# EAGLE design TeenAstro_Mini_v2-5-3_M12_a6 (EAGLE 9.6.2)
TeenAstroMini version 2.5.3 avec codeurs - Teensy 4.0 - connecteurs M12A-05 et RJ45 (encodeurs) - Réticule et capteur limite à câbler - liaison sans soudures encodeurs-Teensy
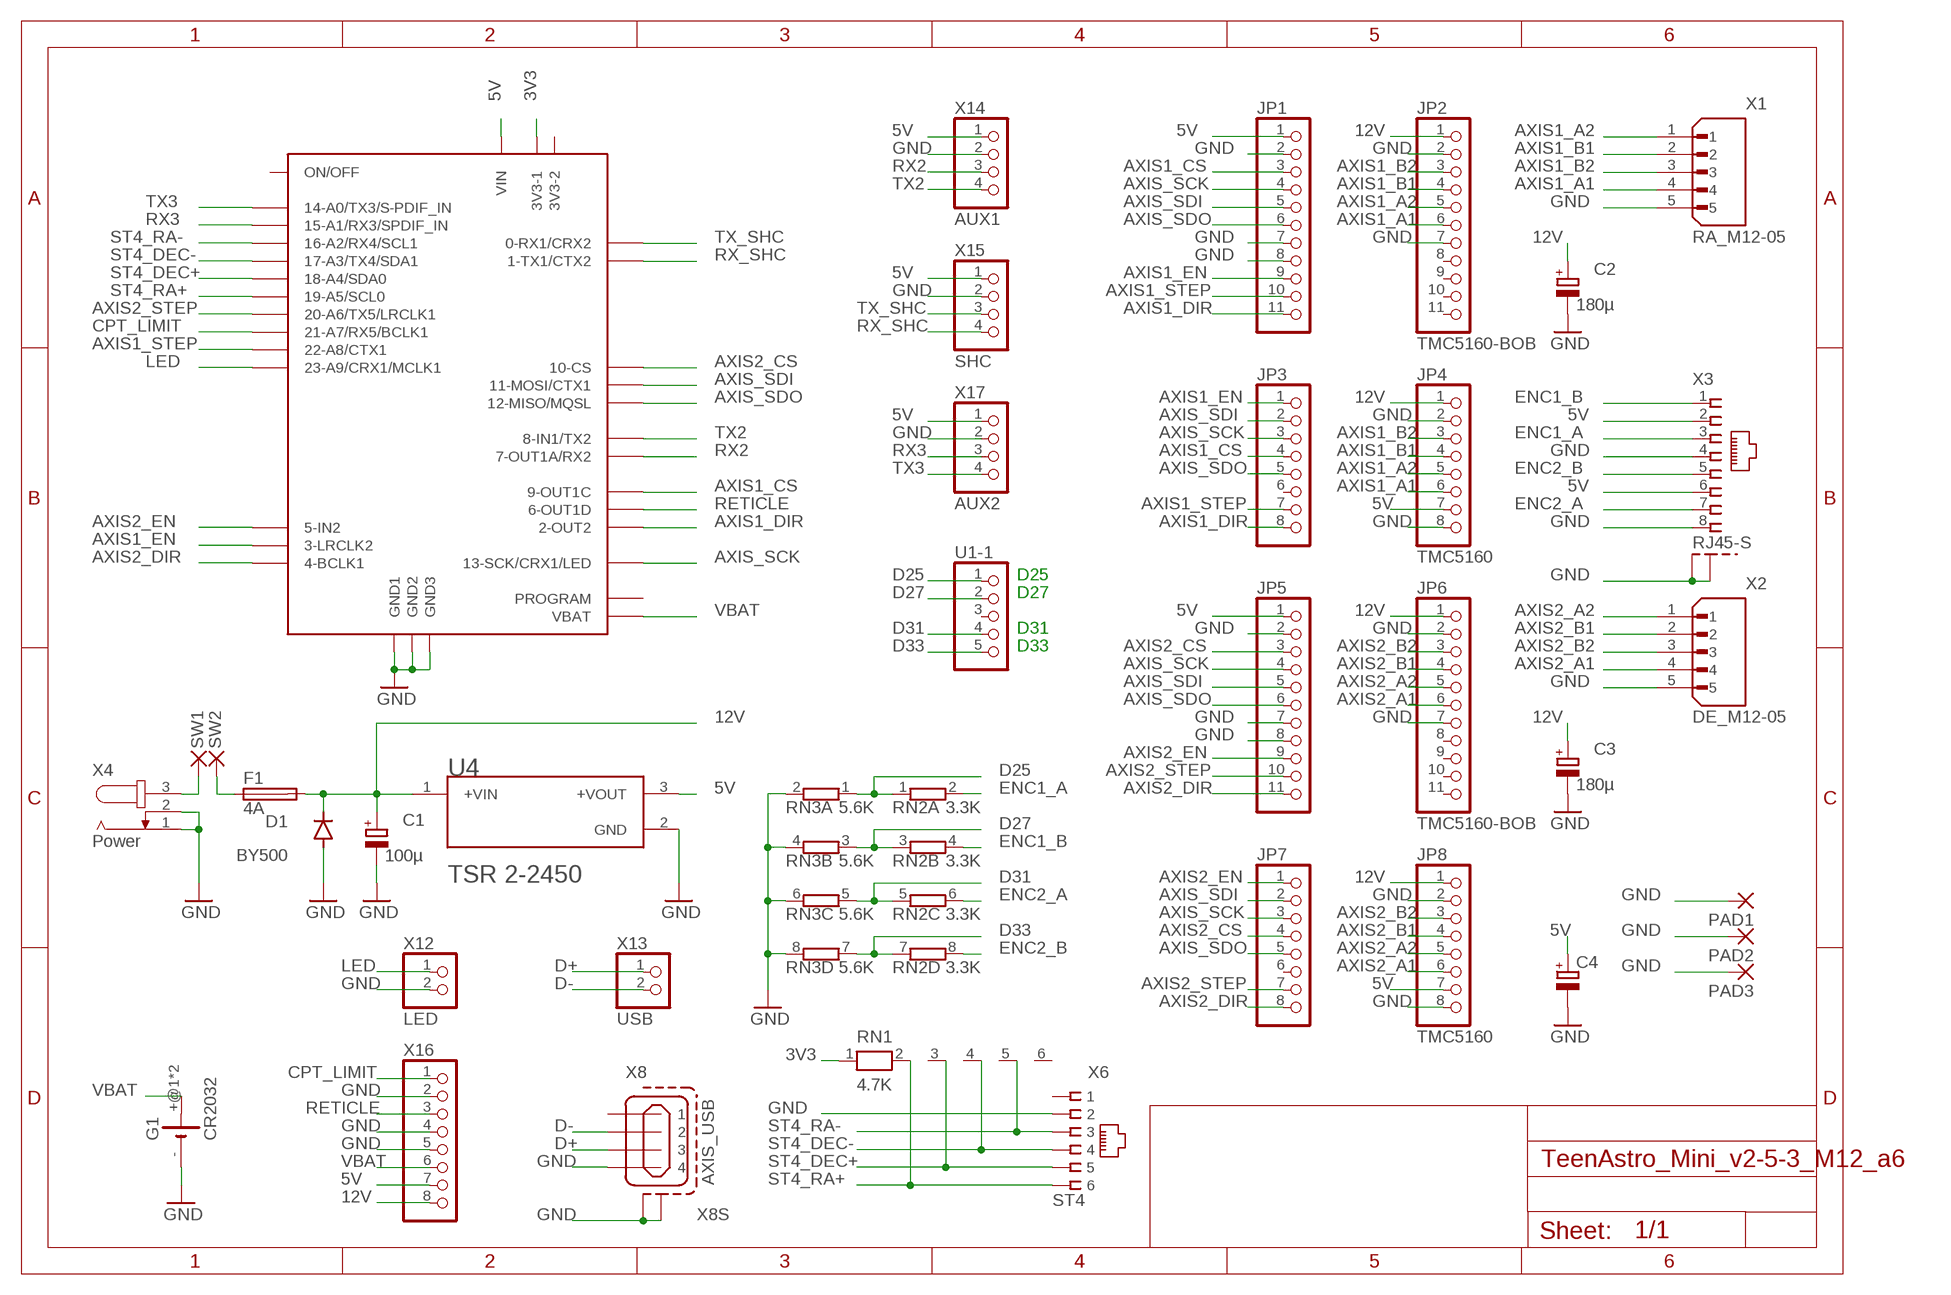
[diagram p0: schematic, sheet 1]

## Parts
C1  100µ  CPOL-EU_TAP5-80  [TAP5-80]
C2  180µ  CPOL-EU_TAP5-80  [TAP5-80]
C3  180µ  CPOL-EU_TAP5-80  [TAP5-80]
C4  CPOL-EUTAP5-45  [TAP5-45]
D1  BY500  [DO201-15]
F1  4A  SH22,5  [SH22,5]
G1  CR2032  BK-888  [BK-888]
JP1  PINHD-1X11/LONG  [1X11]
JP2  TMC5160-BOB  PINHD-1X11/LONG  [1X11]
JP3  PINHD-1X8/LONG  [1X08]
JP4  TMC5160  PINHD-1X8/LONG  [1X08]
JP5  PINHD-1X11/LONG  [1X11]
JP6  TMC5160-BOB  PINHD-1X11/LONG  [1X11]
JP7  PINHD-1X8/LONG  [1X08]
JP8  TMC5160  PINHD-1X8/LONG  [1X08]
PAD1  2,54/1,1  [2,54/1,1]
PAD2  2,54/1,1  [2,54/1,1]
PAD3  2,54/1,1  [2,54/1,1]
RN1  4.7K  RN05  [RN-6]
RN2  3.3K  E4R  [SIL8]
RN3  5.6K  E4R  [SIL8]
SW1  3,17/1,1  [3,17/1,1]
SW2  3,17/1,1  [3,17/1,1]
U1  TEENSY4.0  TEENSY40-A  [TEENSY40A]
U1-1  PINHD-1X5/LONG  [1X05]
U4  TSR_2-2450  TRACOPOWER_TSR_2-2450TRACOPOWER_TSR_2-2450_0_0  [TRACOPOWER_TSR_2-2450_0]
X1  RA_M12-05  M12-05CONEC_43-01198C  [CONEC_43-01198_C]
X2  DE_M12-05  M12-05CONEC_43-01198C  [CONEC_43-01198_C]
X3  RJ45-S  [RJ45-SHIELD]
X4  Power  JACK-PLUG_2.5MM  [SPC4078]
X6  ST4  RJ11-6L-B"  [RJ11-NO_SHIELD]
X8  AXIS_USB  MINI-USB_SHIELD4P-85-32004-00X  [85-32004-00X]
X12  LED  PINHD-1X2/LONG  [1X02]
X13  USB  PINHD-1X2/LONG  [1X02]
X14  AUX1  PINHD-1X4/LONG  [1X04]
X15  SHC  PINHD-1X4/LONG  [1X04]
X16  PINHD-1X8/LONG  [1X08]
X17  AUX2  PINHD-1X4/LONG  [1X04]

## Nets
3V3: RN1.1 U1.3V3-1
5V: C4.+ JP1.1 JP4.7 JP5.1 JP8.7 U1.VIN U4.3(+VOUT) X3.2 X3.6 X14.1 X15.1 X16.7 X17.1
12V: C1.+ C2.+ C3.+ D1.C F1.2 JP2.1 JP4.1 JP6.1 JP8.1 U4.1(+VIN) X16.8
AXIS1_A1: JP2.6 JP4.6 X1.4
AXIS1_A2: JP2.5 JP4.5 X1.1
AXIS1_B1: JP2.4 JP4.4 X1.2
AXIS1_B2: JP2.3 JP4.3 X1.3
AXIS1_CS: JP1.3 JP3.4 U1.9-OUT1C
AXIS1_DIR: JP1.11 JP3.8 U1.2-OUT2
AXIS1_EN: JP1.9 JP3.1 U1.3-LRCLK2
AXIS1_STEP: JP1.10 JP3.7 U1.22-A8/CTX1
AXIS2_A1: JP6.6 JP8.6 X2.4
AXIS2_A2: JP6.5 JP8.5 X2.1
AXIS2_B1: JP6.4 JP8.4 X2.2
AXIS2_B2: JP6.3 JP8.3 X2.3
AXIS2_CS: JP5.3 JP7.4 U1.10-CS/MQSR(10-CS)
AXIS2_DIR: JP5.11 JP7.8 U1.4-BCLK2(4-BCLK1)
AXIS2_EN: JP5.9 JP7.1 U1.5-IN2
AXIS2_STEP: JP5.10 JP7.7 U1.20-A6/TX5/LRCLK1
AXIS_SCK: JP1.4 JP3.3 JP5.4 JP7.3 U1.13-SCK/CRX1/LED
AXIS_SDI: JP1.5 JP3.2 JP5.5 JP7.2 U1.11-MOSI/CTX1
AXIS_SDO: JP1.6 JP3.5 JP5.6 JP7.5 U1.12-MIO/MQSL(12-MISO/MQSL)
CPT_LIMIT: U1.21-A7/RX5/BCLK1 X16.1
D25: RN2.1 RN3.1 U1-1.1
D27: RN2.3 RN3.3 U1-1.2
D31: RN2.5 RN3.5 U1-1.4
D33: RN2.7 RN3.7 U1-1.5
D+: X8.3 X13.1
D-: X8.2 X13.2
ENC1_A: RN2.2 X3.3
ENC1_B: RN2.4 X3.1
ENC2_A: RN2.6 X3.7
ENC2_B: RN2.8 X3.5
GND: C1.- C2.- C3.- C4.- D1.A G1.- JP1.2 JP1.7 JP1.8 JP2.2 JP2.7 JP4.2 JP4.8 JP5.2 JP5.7 JP5.8 JP6.2 JP6.7 JP8.2 JP8.8 PAD1.1(P) PAD2.1(P) PAD3.1(P) RN3.2 RN3.4 RN3.6 RN3.8 U1.GND1 U1.GND2 U1.GND3 U4.2(GND) X1.5 X2.5 X3.4 X3.8 X3.M1(S1) X3.M2(S2) X4.1 X4.2 X6.2 X8.4 X8.M1(S1) X8.M2(S2) X12.2 X14.2 X15.2 X16.2 X16.4 X16.5 X17.2
LED: U1.23-A9/CRX1/CCLK1(23-A9/CRX1/MCLK1) X12.1
N$13: SW1.1(P) X4.3
N$15: F1.1 SW2.1(P)
RETICLE: U1.6-OUT1D X16.3
RX2: U1.7-RX2/OUT1A(7-OUT1A/RX2) X14.3
RX3: U1.15-A1/RX3/S-PDIF_IN(15-A1/RX3/SPDIF_IN) X17.3
RX_SHC: U1.1-TX1(1-TX1/CTX2) X15.4
ST4_DEC+: RN1.3 U1.18-A4/SDA0 X6.5
ST4_DEC-: RN1.4 U1.17-A3/TX4/SDA1 X6.4
ST4_RA+: RN1.2 U1.19-A5/SCL0 X6.6
ST4_RA-: RN1.5 U1.16-A2/RX4/SCL1 X6.3
TX2: U1.8-TX2/IN1(8-IN1/TX2) X14.4
TX3: U1.14-A0/TX3/S-PFI_OUT(14-A0/TX3/S-PDIF_IN) X17.4
TX_SHC: U1.0-RX1(0-RX1/CRX2) X15.3
VBAT: G1.+@1(+) G1.+@2(+) U1.VBAT X16.6
Unconnected: JP2.8 JP2.9 JP2.10 JP2.11 JP3.6 JP6.8 JP6.9 JP6.10 JP6.11 JP7.6 RN1.6 U1-1.3 U1.3V3-2 U1.ON/OFF U1.PROGRAM X6.1 X8.1

## Notes on the sheet
- D25
- D27
- D31
- D33

## Library data of the parts
C1-C3 = my_library:CPOL-EU_: POLARIZED CAPACITOR, European symbol; SPICEPREFIX: C
C4 = rcl_1:CPOL-EU: POLARIZED CAPACITOR, European symbol; SPICEPREFIX: C
D1 = diode:BY500: DIODE fast recovery diode, 5 A, 800 V
F1 = my_library:SH22,5: FUSE HOLDER grid 22,5 mm, OGN0031 8201, Schurter (Buerklin); MF: SCHURTER; MPN: 0031.8201; OC_FARNELL: 1162740; OC_NEWARK: 96F8317
G1 = my_library:BK-888: CION CELL RETAINER FOR 23mm DIA. BATTERIES BR2032, CL2032, CR2032 Source: MEMORY PROTECTION DEVICES; Inc. BK-888-datasheet.pdf
JP1 JP2 JP5 JP6 = pinhead_v2:PINHD-1X11: PIN HEADER
JP3 JP4 JP7 JP8 X16 = pinhead_v2:PINHD-1X8: PIN HEADER
PAD1-PAD3 = wirepad:2,54/1,1: THROUGH-HOLE PAD
RN1 = resistor-net:RN05: RESISTOR NETWORK; OC_FARNELL: unknown; OC_NEWARK: unknown
RN2 RN3 = resistor-sil:E4R: SIL RESISTOR; OC_FARNELL: unknown; OC_NEWARK: unknown
SW1 SW2 = wirepad:3,17/1,1: THROUGH-HOLE PAD
U1 = Teensy_4-x:TEENSY40-A: Teensy 4.0 device without POGO pins for pins 24 - 33, also D+ and D-.
U1-1 = pinhead_v2:PINHD-1X5: PIN HEADER
U4 = Tracopower - TSR 2-2450:TRACOPOWER_TSR_2-2450: Linear Regulator Replacement DC DC Converter Output 5V - - - 2A 6.5V - 36V Input; AUTOMOTIVE: No; CENTROID_NOT_SPECIFIED: No; DATASHEET: https://www.tracopower.com/products/tsr2.pdf; DEVICE_CLASS_L1: Integrated Circuits (ICs); DEVICE_CLASS_L2: Power Management ICs; DEVICE_CLASS_L3: Voltage Regulators - Switching; DIGIKEY_DESCRIPTION: DC DC CONVERTER 5V 10W; DIGIKEY_PART_NUMBER: 1951-2692-ND; FOOTPRINT_VARIANT_NAME_0: Recommended_Land_Pattern; HEIGHT: 10.1mm; LEAD_FREE: Yes; MAX_SUPPLY_VOLTAGE: 36V; MF: Tracopower; MFG_PACKAGE_IDENT: 0; MFG_PACKAGE_IDENT_DATE: 0; MFG_PACKAGE_IDENT_REV: 0; MIN_SUPPLY_VOLTAGE: 6.5V; MOUSER_PART_NUMBER: 495-TSR2-2450; MPN: TSR 2-2450; NUMBER_OF_OUTPUTS: 1; OUTPUT_CURRENT: 2000mA; OUTPUT_TYPE: Fixed; OUTPUT_VOLTAGE: 5V; PACKAGE: PTH_CONVERTER_14MM0_7MM5; PREFIX: U; ROHS: Yes; SWITCHING_FREQUENCY: 1200kHz; SWITCHING_TOPOLOGY: Buck; TEMPERATURE_RANGE_HIGH: +85°C; TEMPERATURE_RANGE_LOW: -40°C; VERIFICATION_VERSION: 0.0.0.3
X1 X2 = my_library:M12-05: Check availability <https://pricing.snapeda.com/parts/T4144015051-000/TE%20Connectivity/view-part?ref=eda>
X3 = my_library:RJ45-S
X4 = my_library:JACK-PLUG_: DC POWER JACK Power Jack, DC, Right Angle, Through Hole, Rated 5A at 16VDC, PC Terminals Distributor: Farnell (www.Farnell.de) Drawing: 84N1161.pdf / 84N1162.pdf Manufacturer: SPC Technology (www.spctechnology.com) Type: SPC4077 / SPC 4078; OC_FARNELL: unknown; OC_NEWARK: unknown
X6 = my_library:RJ11: RJ11 no shield 6P6C; MF: TYCO ELECTRONICS; MPN: RJ11-6L-B; OC_FARNELL: unknown; OC_NEWARK: 52K3613
X8 = my_library:MINI-USB_SHIELD4P-: MINI USB 4 Pol. Source: www.cypressindustries.com; OC_FARNELL: unknown; OC_NEWARK: unknown
X12 X13 = pinhead_v2:PINHD-1X2: PIN HEADER
X14 X15 X17 = pinhead_v2:PINHD-1X4: PIN HEADER

## Board
TeenAstro Mini version 2.5.3 avec codeurs - Teensy 4.0 - Connexion M12A-05 et RJ45 blindé (encodeurs) - batterie coté Cu - pistes à 16 mils
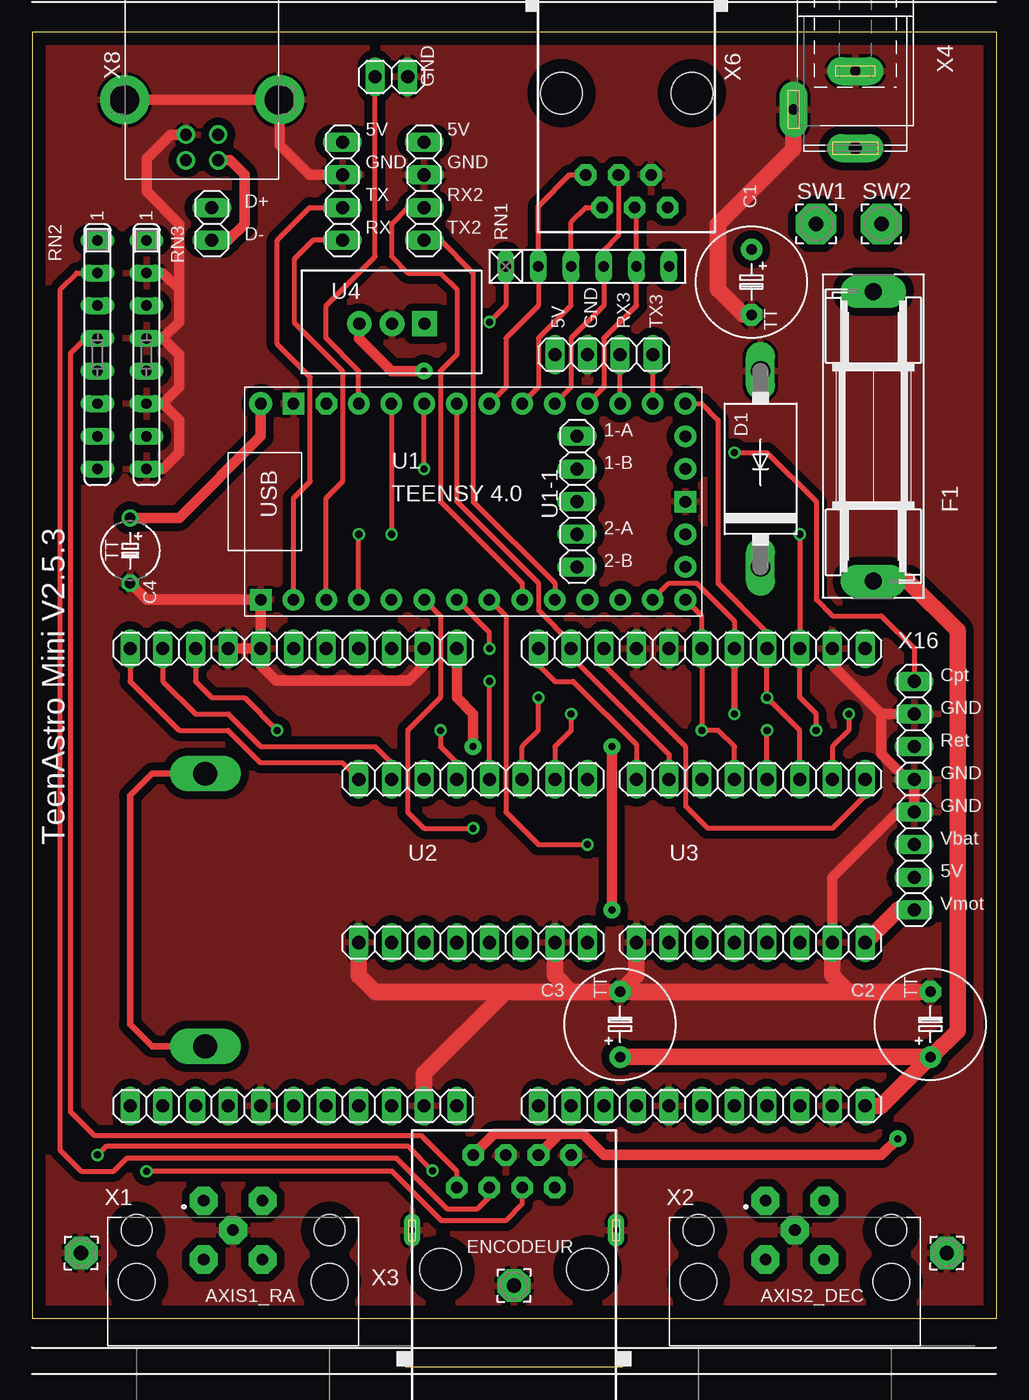
[diagram p1: board, top side]
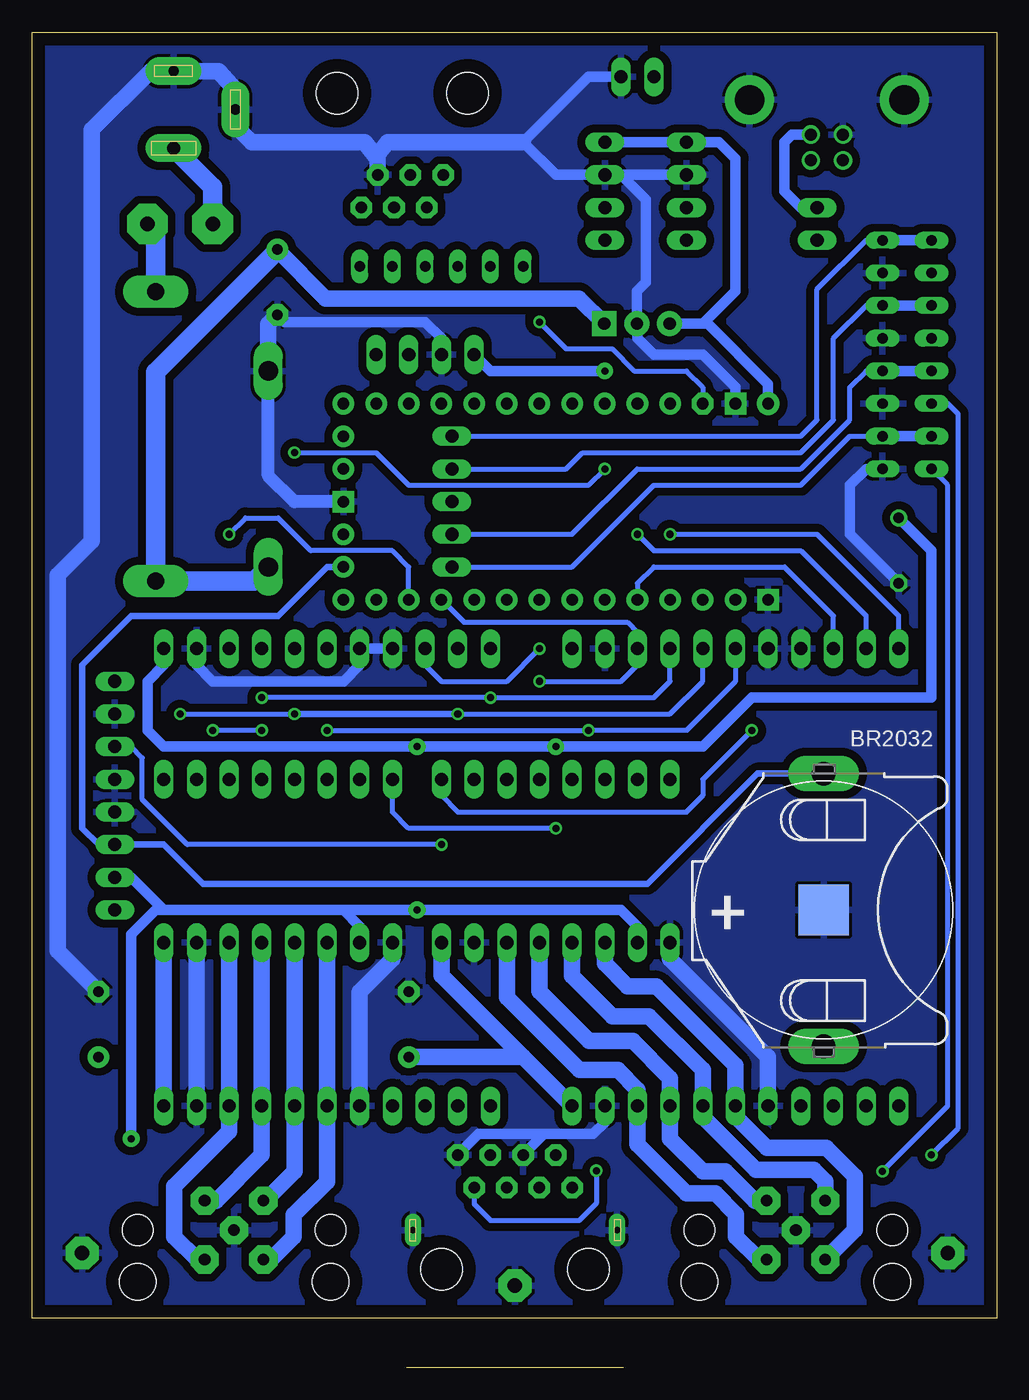
[diagram p2: board, bottom side, seen from below]

Size 75.01 x 100 mm. Coordinates in mm from the lower left corner, seen from the top.
Outline: 0,0 75.01,0 75.01,100 0,100 0,0
Copper layers (1*16): Top 0.035mm / dielectric 1.5mm / Bottom 0.035mm
Design rules "default": minimum track width 6mil, minimum drill 0.35mm, track to track 6mil, track to pad 6mil, pad to pad 6mil, via to via 6mil, smd to smd 6mil, copper to edge 40mil, drill to drill 6mil, minimum pad ring 10mil, minimum via ring 8mil, stop-mask expansion 4mil, vias tented up to drill 0mil, thermal gap 10mil

### Footprints (pad centres in the part's own frame; a part is rotated, then mirrored left to right if it is on the bottom)
TAP5-80 = drill 0.813 pad 1.676: + -2.54,0 | drill 0.813 pad 1.676 octagon: - 2.54,0
TAP5-45 = drill 0.813: + -2.54,0 | drill 0.813 octagon: - 2.54,0
DO201-15 = drill 1.499 long: A 7.62,0; C -7.62,0
SH22,5 = drill 1.321 pad 2.54 long: 1 -11.252,0; 2 11.252,0
BK-888 = drill 1.85 pad 2.54 long: +@1 -10.6,0; +@2 10.6,0 | smd 3.96 x 3.96: - 0,0
1X11 = drill 1.016 long: 1 -12.7,0; 2 -10.16,0; 3 -7.62,0; 4 -5.08,0; 5 -2.54,0; 6 0,0; 7 2.54,0; 8 5.08,0; 9 7.62,0; 10 10.16,0; 11 12.7,0
1X08 = drill 1.016 long: 1 -8.89,0; 2 -6.35,0; 3 -3.81,0; 4 -1.27,0; 5 1.27,0; 6 3.81,0; 7 6.35,0; 8 8.89,0
2,54/1,1 = drill 1.118 pad 2.54 octagon: 1 0,0
RN-6 = drill 0.813 long: 1 -6.35,0; 2 -3.81,0; 3 -1.27,0; 4 1.27,0; 5 3.81,0; 6 6.35,0
SIL8 = drill 0.813 long: 1 -8.89,0; 2 -6.35,0; 3 -3.81,0; 4 -1.27,0; 5 1.27,0; 6 3.81,0; 7 6.35,0; 8 8.89,0
3,17/1,1 = drill 1.118 pad 3.175 octagon: 1 0,0
TEENSY40A = drill 0.9 pad 1.676: 0-RX1 -13.97,-7.62; 1-TX1 -11.43,-7.62; 2-OUT2 -8.89,-7.62; 3-LRCLK2 -6.35,-7.62; 3V3-2 16.51,-2.54; 4-BCLK2 -3.81,-7.62; 5-IN2 -1.27,-7.62; 6-OUT1D 1.27,-7.62; 7-RX2/OUT1A 3.81,-7.62; 8-TX2/IN1 6.35,-7.62; 9-OUT1C 8.89,-7.62; 10-CS/MQSR 11.43,-7.62; 11-MOSI/CTX1 13.97,-7.62; 12-MIO/MQSL 16.51,-7.62; 13-SCK/CRX1/LED 16.51,7.62; 14-A0/TX3/S-PFI_OUT 13.97,7.62; 15-A1/RX3/S-PDIF_IN 11.43,7.62; 16-A2/RX4/SCL1 8.89,7.62; 17-A3/TX4/SDA1 6.35,7.62; 18-A4/SDA0 3.81,7.62; 19-A5/SCL0 1.27,7.62; 20-A6/TX5/LRCLK1 -1.27,7.62; 21-A7/RX5/BCLK1 -3.81,7.62; 22-A8/CTX1 -6.35,7.62; 23-A9/CRX1/CCLK1 -8.89,7.62; ON/OFF 16.51,5.08; PROGRAM 16.51,2.54; VBAT 16.51,-5.08 | drill 0.9 pad 1.676 octagon: 3V3-1 -11.43,7.62 | drill 0.9 pad 1.676 square: GND1 -16.51,-7.62; GND2 16.51,0; GND3 -13.97,7.62 | drill 0.9 pad 1.778: VIN -16.51,7.62
1X05 = drill 1.016 long: 1 -5.08,0; 2 -2.54,0; 3 0,0; 4 2.54,0; 5 5.08,0
TRACOPOWER_TSR_2-2450_0 = drill 0.95 pad 1.93 square: 1 -2.58,0.14 | drill 0.95 pad 1.93: 2 -0.04,0.14; 3 2.5,0.14
CONEC_43-01198_C = drill 0.9 pad 2.184 octagon: 1 -2.286,2.286; 2 2.286,2.286; 3 2.286,-2.286; 4 -2.286,-2.286; 5 0,0 | hole 2.4: -7.5,0; 7.5,0 | hole 2.85: -7.5,-4; 7.5,-4
RJ45-SHIELD = drill 0.9 pad 1.676 octagon: 1 -4.445,6.35; 2 -3.175,8.89; 3 -1.905,6.35; 4 -0.635,8.89; 5 0.635,6.35; 6 1.905,8.89; 7 3.175,6.35; 8 4.445,8.89 | drill 0.508 pad 1.27 long: M1 -7.94,3.048; M2 7.94,3.048 | hole 3.251: -5.715,0; 5.715,0
SPC4078 = drill 0.8 pad 2.184 long: 1 -3,0; 2 0,-4.8 | drill 1 pad 2.184 long: 3 3,0
RJ11-NO_SHIELD = drill 0.9 pad 1.676 octagon: 1 -3.175,8.89; 2 -1.905,6.35; 3 -0.635,8.89; 4 0.635,6.35; 5 1.905,8.89; 6 3.175,6.35 | hole 3.251: -5.08,0; 5.08,0
85-32004-00X = drill 0.92 pad 1.27: 1 4.71,-1.25; 2 4.71,1.25; 3 2.71,1.25; 4 2.71,-1.25 | drill 2.3 pad 3.81: M1 0,6.02; M2 0,-6.02
1X02 = drill 1.016 long: 1 -1.27,0; 2 1.27,0
1X04 = drill 1.016 long: 1 -3.81,0; 2 -1.27,0; 3 1.27,0; 4 3.81,0

### Placement (x,y rotation side)
C1  55.93,80.57 270 top
C2  69.85,22.86 90 top
C3  45.72,22.86 90 top
C4  7.62,59.69 270 top
D1  56.64,66.04 90 top
F1  65.41,68.58 270 top
G1  13.46,31.75 270 bottom
JP1  20.32,52.07 180 top
JP2  20.32,16.51 180 top
JP3  34.29,41.91 180 top
JP4  34.29,29.21 180 top
JP5  52.07,52.07 180 top
JP6  52.07,16.51 180 top
JP7  55.88,41.91 180 top
JP8  55.88,29.21 180 top
PAD1  3.81,5.08 0 top
PAD2  37.47,2.54 0 top
PAD3  71.12,5.08 0 top
RN1  43.18,81.79 0 top
RN2  5.08,74.93 270 top
RN3  8.89,74.93 270 top
SW1  60.96,85.09 0 top
SW2  66.04,85.09 0 top
U1  34.29,63.5 0 top
U1-1  42.37,63.5 270 top
U4  27.94,77.47 180 top
X1  15.62,6.86 0 top
X2  59.31,6.86 0 top
X3  37.47,3.81 0 top
X4  64.01,93.98 270 top
X6  46.23,95.25 180 top
X8  13.21,94.74 270 top
X12  27.94,96.52 0 top
X13  13.97,85.09 270 top
X14  30.48,87.63 270 top
X15  24.13,87.63 270 top
X16  68.58,40.64 270 top
X17  44.45,74.93 0 top

### Tracks (layer width: path | path; a pad name or v marks a point on that pad's centre or on a via)
3V3  (via drill 0.55)
  Top 0.406: RN1.1 36.83,78.74 v35.56,77.47
  Bottom 0.406: v35.56,77.47 33.48,75.39 29.92,75.39 28.19,73.66 24.13,73.66 22.86,72.39 U1.3V3-1
5V  (via drill 0.55 pad 1.3)
  Top 0.813: JP1.1 33.02,48.26 34.29,46.99 v34.29,44.45 | v45.09,31.75 v45.09,44.45 | v30.48,73.66 27.94,73.66 25.44,76.16 U4.3 | X3.6 41,14.33 | 41,14.33 35.92,14.33 X3.2 | 41,14.33 42.82,14.33 44.45,12.7 66.04,12.7 v67.31,13.97 | C4.+ 11.43,62.23 17.78,68.58 U1.VIN
  Bottom 0.813: JP5.1 64.77,50.8 66.04,49.53 66.04,45.72 64.77,44.45 v45.09,44.45 v34.29,44.45 22.86,44.45 19.05,48.26 5.08,48.26 5.08,59.69 C4.+ | 50.8,31.75 49.53,30.48 JP8.7 | JP4.7 27.94,30.48 29.21,31.75 v45.09,31.75 50.8,31.75 | 64.77,31.75 67.31,34.29 X16.7 | 64.77,31.75 50.8,31.75 | U1.VIN 17.78,72.64 22.47,77.33 22.86,77.33 | 22.86,77.33 U4.3 | 22.86,77.33 20.32,79.87 20.32,90.17 21.59,91.44 X15.1 X14.1 | X17.1 39.37,73.66 v30.48,73.66 | 64.77,31.75 65.42,31.75 67.31,29.86 v67.31,13.97
12V
  Top 1.27: C3.+ C2.+ 66.04,16.51 JP6.1 | JP8.1 67.31,31.75 X16.8 | 69.92,20.32 71.96,22.36 71.96,53.47 68.1,57.33 F1.2
  Top 1.524: C2.+ 69.92,20.32
  Bottom 1.27: JP2.1 36.83,20.32 | 36.83,20.32 C3.+ | JP4.1 43.18,26.67 36.83,20.32 | JP8.1 JP6.1 | C1.+ 55.93,83.06 52.17,79.3 32.49,79.3 U4.1
  Bottom 1.524: D1.C 57.73,57.33 F1.2 65.41,73.58 55.93,83.06
AXIS1_A1
  Bottom 1.27: JP4.6 30.48,27.58 28.7,25.81 26.47,25.81 20.32,19.66 JP2.6 20.32,15.7 17.88,13.26 13.26,13.26 11.03,11.03 11.03,6.88 X1.4
AXIS1_A2
  Bottom 1.27: JP4.5 33.02,26.62 29.9,23.5 27.05,23.5 22.86,19.3 JP2.5 22.86,15.65 18.75,11.53 14.22,11.53 13.34,10.64 X1.1
AXIS1_B1
  Bottom 1.27: JP4.4 35.56,25.43 31.7,21.57 28.3,21.57 25.4,18.67 JP2.4 25.4,13.97 22.86,11.43 21.11,11.43 18.82,9.14 X1.2
AXIS1_B2
  Bottom 1.27: JP4.3 38.1,24.94 32.46,19.3 29.46,19.3 27.94,17.78 JP2.3 27.94,13.51 24.14,9.71 21.89,9.71 20.27,8.09 20.27,6.35 18.49,4.57 X1.3
AXIS1_CS  (via drill 0.55)
  Top 0.406: JP3.4 v35.56,49.53
  Bottom 0.406: U1.9-OUT1C 41.43,54.13 28.73,54.13 27.94,53.34 JP1.3 27.94,50.8 29.21,49.53 v35.56,49.53
AXIS1_DIR  (via drill 0.55)
  Top 0.406: U1.2-OUT2 v25.4,60.96 | JP1.11 7.62,49.53 11.43,45.72 15.24,45.72 17.78,43.18 24.13,43.18 JP3.8
  Bottom 0.406: JP1.11 7.62,54.61 13.97,60.96 v25.4,60.96
AXIS1_EN  (via drill 0.55)
  Top 0.406: v19.05,45.72 16.51,48.26 13.97,48.26 12.7,49.53 JP1.9
  Bottom 0.406: JP1.9 12.7,54.61 16.51,58.42 26.67,58.42 27.94,57.15 U1.3-LRCLK2 | JP3.1 43.18,40.64 41.91,39.37 24.13,39.37 22.86,40.64 22.86,41.91 v19.05,45.72
AXIS1_STEP  (via drill 0.55)
  Top 0.406: JP3.7 27.94,43.18 26.67,44.45 17.78,44.45 15.24,46.99 12.7,46.99 10.16,49.53 JP1.10 | U1.22-A8/CTX1 v27.94,60.96
  Bottom 0.406: JP1.10 10.16,54.61 15.24,59.69 26.67,59.69 v27.94,60.96
AXIS2_A1
  Bottom 1.27: JP8.6 JP6.6 52.07,10.63 54.66,8.04 54.66,6.35 56.44,4.57 X2.4
AXIS2_A2
  Bottom 1.27: JP8.5 JP6.5 54.61,11.43 56.9,9.14 X2.1
AXIS2_B1
  Bottom 1.27: JP8.4 JP6.4 57.15,12.7 60.71,9.14 X2.2
AXIS2_B2
  Bottom 1.27: JP8.3 JP6.3 59.69,14.53 63.96,10.26 63.96,6.35 62.18,4.57 X2.3
AXIS2_CS  (via drill 0.55)
  Top 0.406: v59.69,60.96 JP5.3 59.69,48.26 60.96,46.99 v60.96,45.72 | JP7.4 v57.15,45.72
  Bottom 0.406: v59.69,60.96 58.42,62.23 55.88,62.23 53.34,59.69 46.99,59.69 45.72,58.42 U1.10-CS/MQSR | v57.15,45.72 v60.96,45.72
AXIS2_DIR  (via drill 0.55)
  Top 0.406: JP5.11 39.37,50.8 40.64,49.53 42.06,49.53 46.99,44.6 JP7.8 | U1.4-BCLK2 31.75,54.61 31.75,48.26 29.21,45.72 29.21,39.37 30.48,38.1 v34.29,38.1
  Bottom 0.406: v34.29,38.1 45.72,38.1 46.99,39.37 JP7.8
AXIS2_EN  (via drill 0.55)
  Top 0.406: JP7.1 64.77,40.64 62.23,38.1 52.53,38.1 50.8,39.83 50.8,44.45 44.45,50.8 JP5.9 | v35.56,52.07 35.56,53.34 U1.5-IN2
  Bottom 0.406: JP5.9 44.45,50.8 43.18,49.53 38.1,49.53 v35.56,52.07
AXIS2_STEP
  Top 0.406: JP7.7 49.53,43.84 41.91,51.46 JP5.10 41.91,52.52 39.4,55.03 39.4,57.12 33.02,63.5 U1.20-A6/TX5/LRCLK1
AXIS_SCK  (via drill 0.55)
  Top 0.406: JP3.3 38.1,44.45 39.37,45.72 v39.37,48.26 | JP7.3 59.69,45.72 v57.15,48.26 JP5.4 57.15,53.34 53.34,57.15 53.34,69.85 52.07,71.12 U1.13-SCK/CRX1/LED
  Bottom 0.406: JP1.4 25.4,49.53 26.67,48.26 v39.37,48.26 v57.15,48.26
AXIS_SDI  (via drill 0.55)
  Top 0.406: v63.5,46.99 63.5,45.72 62.23,44.45 JP7.2 | v41.91,46.99 41.91,45.72 40.64,44.45 JP3.2 | U1.11-MOSI/CTX1 49.53,57.15 51.66,57.15 54.61,54.2 JP5.5
  Top 0.508: v54.61,46.99 JP5.5
  Bottom 0.406: v63.5,46.99 v54.61,46.99 | v41.91,46.99 25.4,46.99 22.86,49.53 JP1.5
  Bottom 0.508: v54.61,46.99 v41.91,46.99
AXIS_SDO  (via drill 0.55)
  Top 0.406: JP7.5 54.61,44.45 53.34,45.72 v52.07,45.72 JP5.6 52.07,54.61 U1.12-MIO/MQSL | v31.75,45.72 31.75,44.45 33.02,43.18 JP3.5
  Bottom 0.406: v52.07,45.72 v31.75,45.72 24.13,45.72 20.32,49.53 JP1.6
CPT_LIMIT  (via drill 0.55)
  Top 0.406: v54.61,67.31 57.15,67.31 60.96,63.5 60.96,55.88 62.23,54.61 66.04,54.61 68.58,52.07 X16.1 | v30.48,66.04 U1.21-A7/RX5/BCLK1
  Bottom 0.406: v54.61,67.31 48.26,67.31 45.72,64.77 31.75,64.77 v30.48,66.04
D25
  Bottom 0.406: U1-1.1 15.24,68.58 13.97,69.85 13.97,80.01 10.16,83.82 RN3.1
  Bottom 0.813: RN2.1 RN3.1
D27
  Bottom 0.406: U1-1.2 33.48,66.04 32.21,67.31 15.24,67.31 12.7,69.85 12.7,76.2 10.16,78.74 RN3.3
  Bottom 0.813: RN2.3 RN3.3
D31
  Bottom 0.406: U1-1.4 33.02,60.96 27.94,66.04 15.24,66.04 11.43,69.85 11.43,72.39 10.16,73.66 RN3.5
  Bottom 0.813: RN2.5 RN3.5
D33
  Bottom 0.406: U1-1.5 33.02,58.42 26.67,64.77 15.24,64.77 11.43,68.58 RN3.7
  Bottom 0.813: RN2.7 RN3.7
D+
  Bottom 0.813: X8.3 15.92,92.03 16.51,91.44 16.51,87.63 15.24,86.36 X13.1
D-
  Top 0.813: X8.2 15.38,90.03 16.51,88.9 16.51,85.09 15.24,83.82 X13.2
ENC1_A
  Top 0.406: X3.3 35.56,9.45 34.65,8.53 32.26,8.53 28.35,12.45 7.37,12.45 6.35,11.43 3.81,11.43 2.18,13.06 2.18,80.01 3.45,81.28 RN2.2
ENC1_B
  Top 0.406: X3.1 33.02,11.43 30.23,14.22 4.83,14.22 3,16.05 3,75.03 4.17,76.2 RN2.4
ENC2_A  (via drill 0.55)
  Top 0.406: v31.14,11.48 29.26,13.36 5.74,13.36 v5.08,12.7
  Bottom 0.406: v31.14,11.48 31.14,8.94 32.46,7.62 39.37,7.62 40.64,8.89 X3.7 | v5.08,12.7 3,14.78 3,70.31 3.81,71.12 RN2.6
ENC2_B  (via drill 0.55)
  Top 0.406: v8.89,11.43 27.99,11.43 31.8,7.62 36.83,7.62 38.1,8.89 X3.5
  Bottom 0.406: v8.89,11.43 3.81,16.51 3.81,64.77 RN2.8
GND
  Top 0.813: JP1.8 JP1.7 | JP1.7 U1.GND1 8.89,55.88 C4.- | JP8.2 62.23,34.29 67.31,39.37 | JP1.7 17.78,50.8 18.97,49.61 29.29,49.61 30.48,50.8 JP1.2 | 10.16,71.12 11.43,69.85 11.43,67.31 10.16,66.04 RN3.8 | RN3.6 10.16,71.12 | 10.16,76.2 11.43,77.47 11.43,80.01 | RN3.2 10.16,81.28 11.43,80.01 | RN3.4 10.16,76.2 | 10.16,76.2 11.43,74.93 11.43,72.39 10.16,71.12 | 11.43,80.01 11.43,85.09 8.89,87.63 8.89,90.17 10.75,92.03 X8.4 | X8.M2 X8.M1 19.23,91.26 21.59,88.9 X15.2 | JP5.2 62.23,50.8 66.04,46.99 | 66.04,46.99 X16.2 | 66.04,46.99 66.04,43.89 68.02,41.91 X16.4 X16.5
  Top 1.27: 41.91,25.4 40.64,26.67 JP4.2 | C3.- 46.99,26.67 JP8.8 | C2.- 63.5,25.4 | 63.5,25.4 C3.- | X4.2 59.21,90.96 53.34,85.09 53.34,80.01 55.32,78.03 C1.- | C3.- 41.91,25.4 | 41.91,25.4 36.83,25.4 | 36.83,25.4 26.67,25.4 25.4,26.67 JP4.8 | JP2.2 30.48,19.05 36.83,25.4 | JP8.2 62.23,26.67 63.5,25.4
  Bottom 0.813: JP5.8 JP5.7 49.53,50.8 50.8,49.53 60.96,49.53 62.23,50.8 JP5.2 | U1.GND3 20.32,72.39 22.86,74.93 26.67,74.93 27.94,76.2 27.94,77.37 U4.2 27.98,79.87 27.28,80.57 27.28,86.97 29.21,88.9 X14.2 | X15.2 X14.2 | X14.2 34.29,88.9 36.83,91.44 31.75,96.52 X12.2 | X17.2 43.18,76.2 44.45,77.47 55.37,77.47 C1.- | JP2.2 30.48,15.24 31.39,14.33 35.2,14.33 | X3.4 35.2,14.33 | 35.2,14.33 40.28,14.33 X3.8 | C4.- 11.43,60.96 11.43,64.77 10.16,66.04 RN3.8
  Bottom 1.016: U1.GND2 54.61,63.5 56.64,65.53 D1.A
  Bottom 1.27: 36.83,91.44 47.37,91.44 48.13,90.49 X6.2 48.13,90.17 49.15,91.44 57.94,91.44 59.21,92.71 X4.2 59.21,95.53 60.49,96.98 X4.1 65.79,96.98 70.36,92.41 70.36,60.45 73.03,57.78 73.03,28.57 C2.- | C1.- 56.64,77.32 D1.A | JP6.2 JP8.2 | JP2.7 17.78,20.32 25.4,27.94 JP4.8 | JP6.7 49.53,25.4 46.99,27.94 JP8.8
  pour Top (isolate 0.61): 0,0 74.93,0 74.93,100.33 0,100.33
  pour Bottom (isolate 0.61): 0,0 74.93,0 74.93,100.33 0,100.33
LED
  Top 0.406: U1.23-A9/CRX1/CCLK1 25.4,73.66 22.86,76.2 22.86,78.74 26.67,82.55 X12.1
N$13
  Bottom 1.524: SW1.1 60.96,87.93 X4.3
N$15
  Bottom 1.524: F1.1 65.41,84.45 SW2.1
RETICLE  (via drill 0.55)
  Top 0.406: U1.6-OUT1D 36.83,54.61 36.83,39.37 39.37,36.83 v43.18,36.83
  Bottom 0.406: v43.18,36.83 62.94,36.83 66.45,40.34 66.45,43.59 67.31,44.45 X16.3
RX2
  Top 0.406: X14.3 29.21,86.36 27.94,85.09 27.94,82.55 29.21,81.28 31.75,81.28 33.02,80.01 33.02,74.93 31.75,73.66 31.75,63.5 38.1,57.15 U1.7-RX2/OUT1A
RX3
  Top 0.406: U1.15-A1/RX3/S-PDIF_IN X17.3
RX_SHC
  Top 0.406: U1.1-TX1 22.86,63.78 24.13,65.05 24.13,73.66 20.42,77.37 20.42,82.4 21.84,83.82 X15.4
ST4_DEC+
  Top 0.406: X6.5 43.05,86.36 41.91,85.22 RN1.3 41.91,78.74 39.37,76.2 39.37,72.39 U1.18-A4/SDA0
ST4_DEC-
  Top 0.406: X6.4 45.59,84.2 44.45,83.06 RN1.4 44.45,78.74 41.91,76.2 41.91,72.39 U1.17-A3/TX4/SDA1
ST4_RA+
  Top 0.406: X6.6 41.78,88.9 39.37,86.49 RN1.2 39.37,78.74 36.83,76.2 36.83,72.39 U1.19-A5/SCL0
ST4_RA-
  Top 0.406: 46.99,85.72 RN1.5 46.99,78.74 44.45,76.2 44.45,72.39 U1.16-A2/RX4/SCL1
  Top 0.508: 46.99,85.72 X6.3
TX2
  Top 0.406: X14.4 31.75,83.82 34.29,81.28 34.29,63.5 40.64,57.15 U1.8-TX2/IN1
TX3
  Top 0.406: U1.14-A0/TX3/S-PFI_OUT X17.4
TX_SHC
  Top 0.406: U1.0-RX1 20.3,55.91 20.3,63.75 21.61,65.08 21.61,73.18 19.05,75.74 19.05,83.82 21.59,86.36 X15.3
VBAT
  Top 0.508: G1.+@1 9.33,42.35 7.62,40.64 7.62,22.86 9.33,21.15 G1.+@2
  Bottom 0.508: U1.VBAT 52.07,58.42 55.88,54.61 67.31,54.61 71.12,50.8 71.12,38.1 69.85,36.83 X16.6 64.77,36.83 61.72,33.78 27.18,33.78 18.61,42.35 G1.+@1
(copper drawn outside any net)
  shapes: Bottom area x1, Top area x1

### Text on the board
tPlace: GND | 5V | 5V | GND | GND | TX | RX2 | D+ | D- | RX | TX2 | 5V | GND | RX3 | TX3 | 1-A | U1 | 1-B | 2-A | 2-B | X16 | Cpt | GND | Ret | GND | GND | TeenAstro Mini V2.5.3 | Vbat | U2 | U3 | 5V | Vmot | ENCODEUR | AXIS1_RA | AXIS2_DEC
bPlace: BR2032